# Altium project swagrocket555.PrjPcb
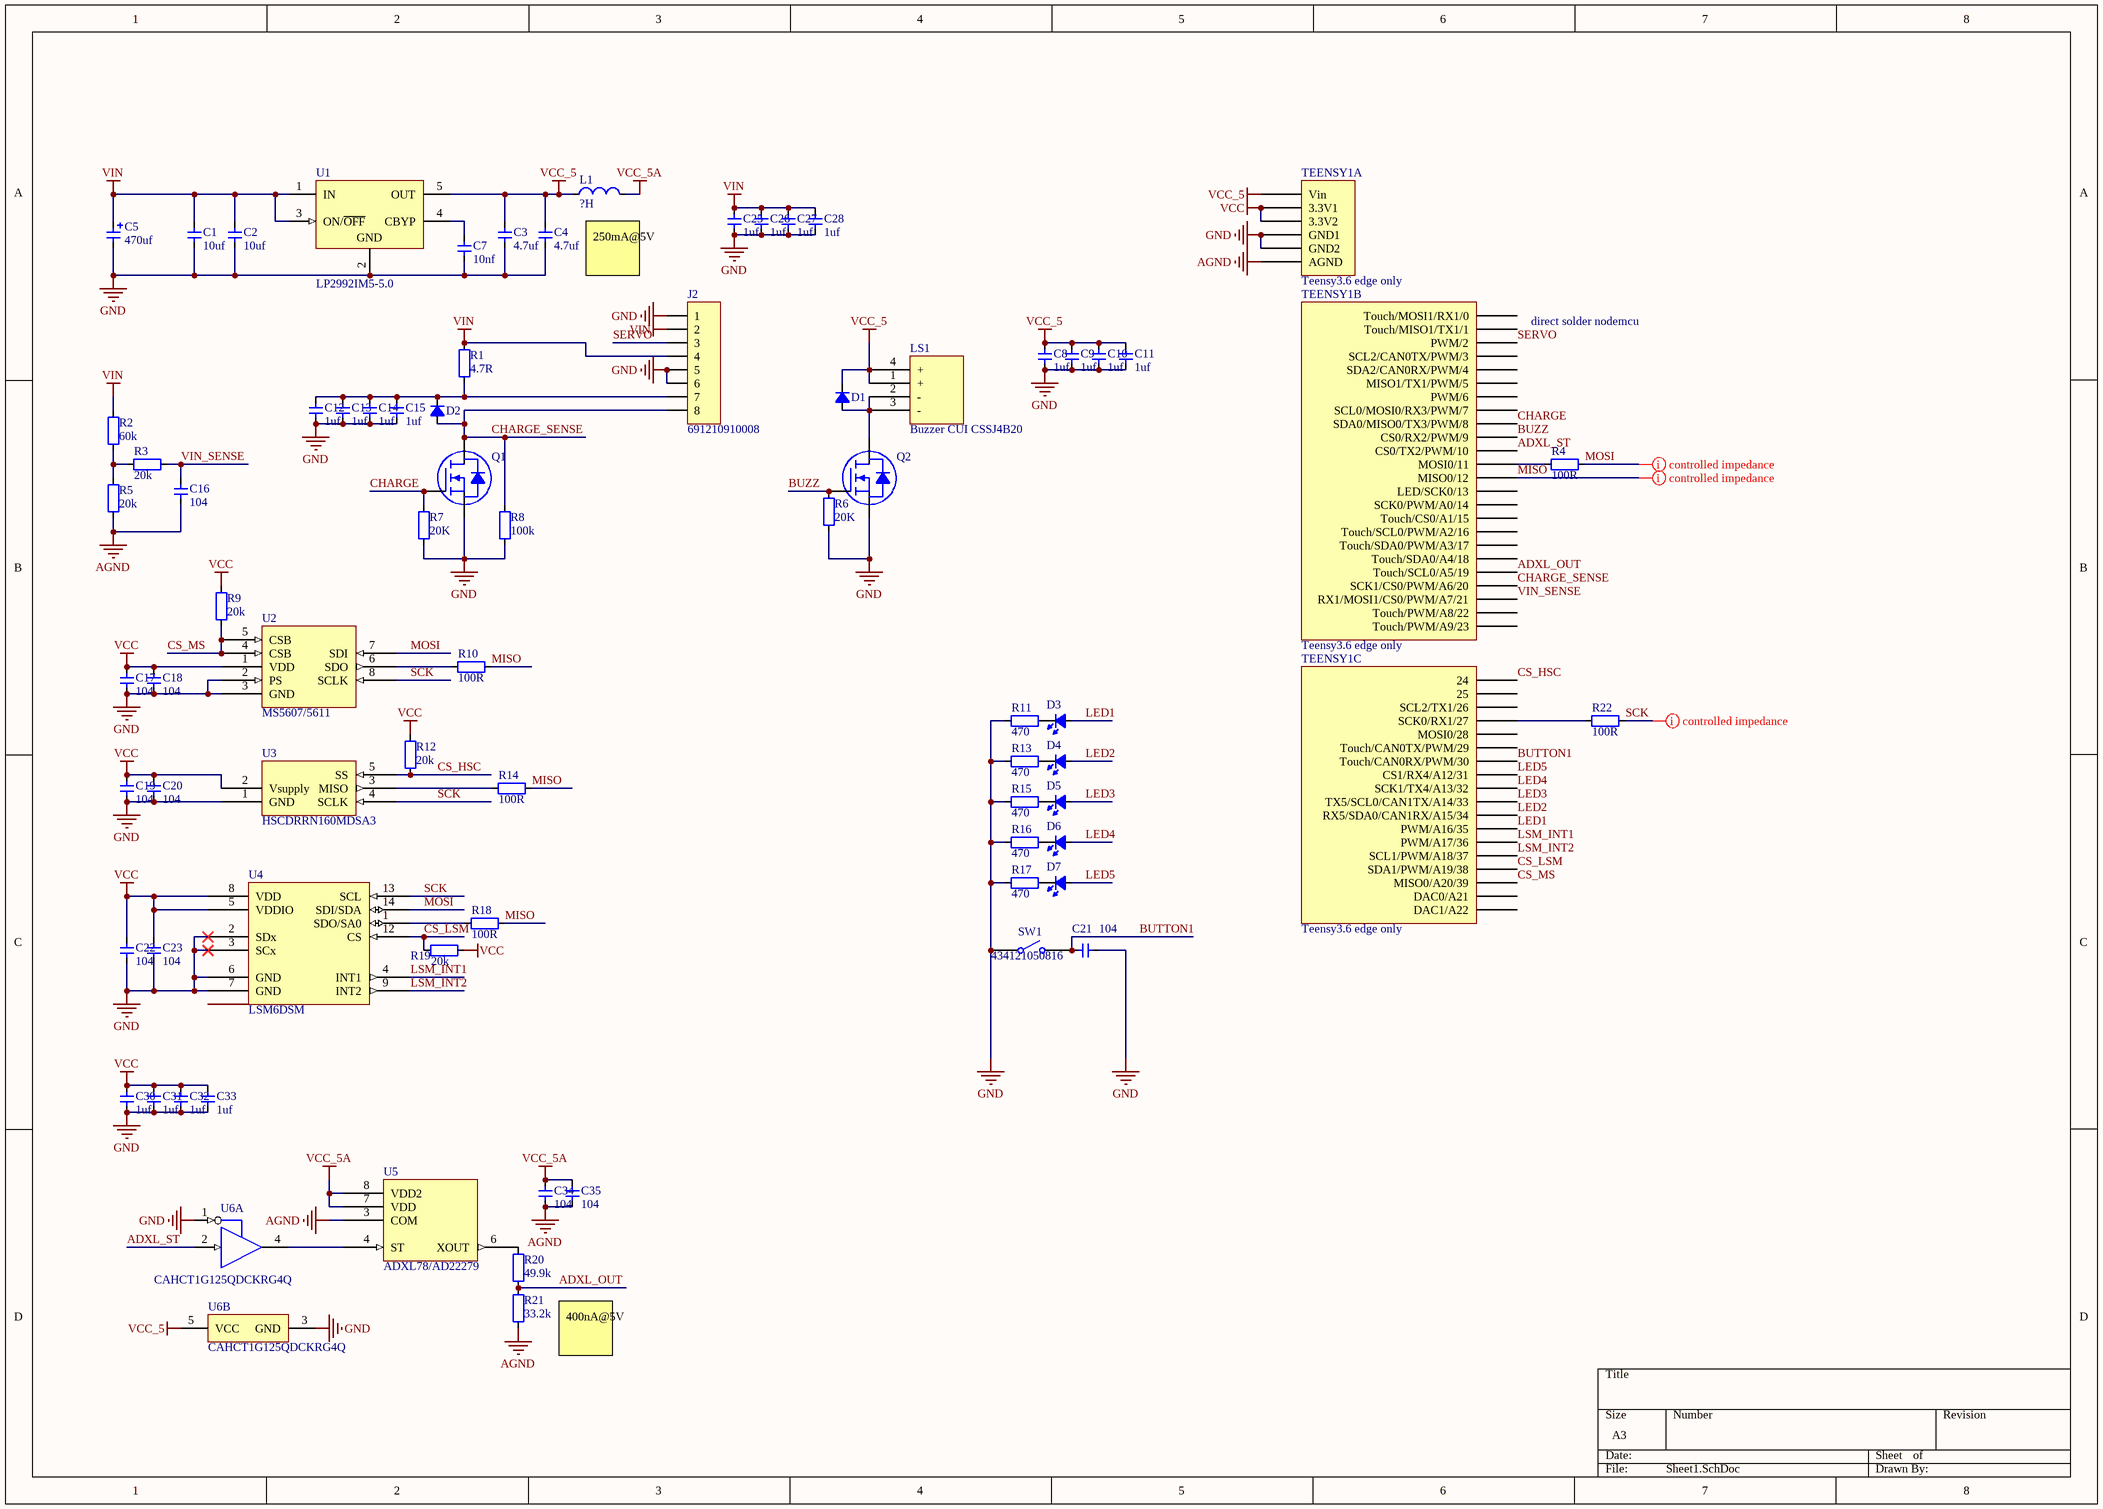
[diagram p0: Sheet1.SchDoc]
1 sheet, 74 parts. Net scope: global (net labels, ports and power ports of the same name join across sheets).
Board file: PCB1.PcbDoc

## Sheet Sheet1.SchDoc
size A3

### Parts
C1  value 10uf  [CAP_0805]  (hidden comment: Cap_0805)
C2  value 10uf  [CAP_0805]  (hidden comment: Cap_0805)
C3  value 4.7uf  [CAP_0805]  (hidden comment: Cap_0805)
C4  value 4.7uf  [CAP_0805]  (hidden comment: Cap_0805)
C5  value 470uf  [OFF_BOARD_CAP_3.5mm]  (hidden comment: Cap_Tan_2917)
C7  value 10nf  [CAP_0402]  (hidden comment: Cap_0402)
C8  value 1uf  [CAP_0603]  (hidden comment: Cap_0603)
C9  value 1uf  [CAP_0603]  (hidden comment: Cap_0603)
C10  value 1uf  [CAP_0603]  (hidden comment: Cap_0603)
C11  value 1uf  [CAP_0603]  (hidden comment: Cap_0603)
C12  value 1uf  [CAP_0603]  (hidden comment: Cap_0603)
C13  value 1uf  [CAP_0603]  (hidden comment: Cap_0603)
C14  value 1uf  [CAP_0603]  (hidden comment: Cap_0603)
C15  value 1uf  [CAP_0603]  (hidden comment: Cap_0603)
C16  value 104  [CAP_0402]  (hidden comment: Cap_0402)
C17  value 104  [CAP_0402]  (hidden comment: Cap_0402)
C18  value 104  [CAP_0402]  (hidden comment: Cap_0402)
C19  value 104  [CAP_0402]  (hidden comment: Cap_0402)
C20  value 104  [CAP_0402]  (hidden comment: Cap_0402)
C21  value 104  [CAP_0402]  (hidden comment: Cap_0402)
C22  value 104  [CAP_0402]  (hidden comment: Cap_0402)
C23  value 104  [CAP_0402]  (hidden comment: Cap_0402)
C25  value 1uf  [CAP_0603]  (hidden comment: Cap_0603)
C26  value 1uf  [CAP_0603]  (hidden comment: Cap_0603)
C27  value 1uf  [CAP_0603]  (hidden comment: Cap_0603)
C28  value 1uf  [CAP_0603]  (hidden comment: Cap_0603)
C30  value 1uf  [CAP_0603]  (hidden comment: Cap_0603)
C31  value 1uf  [CAP_0603]  (hidden comment: Cap_0603)
C32  value 1uf  [CAP_0603]  (hidden comment: Cap_0603)
C33  value 1uf  [CAP_0603]  (hidden comment: Cap_0603)
C34  value 104  [CAP_0402]  (hidden comment: Cap_0402)
C35  value 104  [CAP_0402]  (hidden comment: Cap_0402)
D1  Diode_SOD523  [SOT95P240X120-3N]  (value not drawn)
D2  Diode_SOD523  [SOT95P240X120-3N]  (value not drawn)
D3  LED_0402  [LED_0402_RED]  (value not drawn)
D4  LED_0402  [LED_0402_RED]  (value not drawn)
D5  LED_0402  [LED_0402_RED]  (value not drawn)
D6  LED_0402  [LED_0402_RED]  (value not drawn)
D7  LED_0402  [LED_0402_RED]  (value not drawn)
J2  691210910008  [691210910008]
L1  value ?H  [IND_0603]  (hidden comment: Ind_0603)
LS1  Buzzer CUI CSSJ4B20  [CUI Buzzer 8.5]
Q1  INFINEON MOSFET N-CH SOT-23-3  [INFINEON SOT-23-3]  (value not drawn)
Q2  INFINEON MOSFET N-CH SOT-23-3  [INFINEON SOT-23-3]  (value not drawn)
R1  value 4.7R  [RES_0805]  (hidden comment: Res_0805)
R2  value 60k  [RES_0402]  (hidden comment: Res_0402)
R3  value 20k  [RES_0402]  (hidden comment: Res_0402)
R4  value 100R  [RES_0402]  (hidden comment: Res_0402)
R5  value 20k  [RES_0402]  (hidden comment: Res_0402)
R6  value 20K  [RES_0402]  (hidden comment: Res_0402)
R7  value 20K  [RES_0402]  (hidden comment: Res_0402)
R8  value 100k  [RES_0402]  (hidden comment: Res_0402)
R9  value 20k  [RES_0402]  (hidden comment: Res_0402)
R10  value 100R  [RES_0402]  (hidden comment: Res_0402)
R11  value 470  [RES_0402]  (hidden comment: Res_0402)
R12  value 20k  [RES_0402]  (hidden comment: Res_0402)
R13  value 470  [RES_0402]  (hidden comment: Res_0402)
R14  value 100R  [RES_0402]  (hidden comment: Res_0402)
R15  value 470  [RES_0402]  (hidden comment: Res_0402)
R16  value 470  [RES_0402]  (hidden comment: Res_0402)
R17  value 470  [RES_0402]  (hidden comment: Res_0402)
R18  value 100R  [RES_0402]  (hidden comment: Res_0402)
R19  value 20k  [RES_0402]  (hidden comment: Res_0402)
R20  value 49.9k  [RES_0402]  (hidden comment: Res_0402)
R21  value 33.2k  [RES_0402]  (hidden comment: Res_0402)
R22  value 100R  [RES_0402]  (hidden comment: Res_0402)
SW1  434121050816  [434121050816]
TEENSY1  Teensy3.6 edge only  [Teensy3.6-edgeonly]  (parts A,B,C of 3)
U1  LP2992IM5-5.0  [DBV0005A_N]
U2  MS5607/5611  [MS5611]
U3  HSCDRRN160MDSA3  [honeywell-hsc-DIP8]
U4  LSM6DSM  [LGA14L_DOT_INDICATOR]
U5  ADXL78/AD22279  [ADI-E-8-1_V]
U6  CAHCT1G125QDCKRG4Q  [DCK0005A_M]  (parts A,B of 2)

### Nets
AGND: C16.1 C34.1 C35.1 R5.1 R21.1 TEENSY1.AGND U5.3(COM)
GND: C1.1 C2.1 C3.1 C4.1 C5.2 C7.1 C8.1 C9.1 C10.1 C11.1 C12.1 C13.1 C14.1 C15.1 C17.1 C18.1 C19.1 C20.1 C21.2 C22.1 C23.1 C25.1 C26.1 C27.1 C28.1 C30.1 C31.1 C32.1 C33.1 J2.1 J2.5 J2.6 Q1.3(S) Q2.3(S) R6.1 R7.1 R8.1 R11.1 R13.1 R15.1 R16.1 R17.1 SW1.1 TEENSY1.GND1 TEENSY1.GND2 U1.2(GND) U2.2(PS) U2.3(GND) U3.1(GND) U4.2(SDx) U4.3(SCx) U4.6(GND) U4.7(GND) U6.1(~{OE}) U6.3(GND)
VCC: C17.2 C18.2 C19.2 C20.2 C22.2 C23.2 C30.2 C31.2 C32.2 C33.2 R9.2 R12.2 R19.2 TEENSY1.3.3V1 TEENSY1.3.3V2 U2.1(VDD) U3.2(Vsupply) U4.5(VDDIO) U4.8(VDD)
VCC_5: C3.2 C4.2 C8.2 C9.2 C10.2 C11.2 D1.2(K) L1.1 LS1.1(+) LS1.4(+) TEENSY1.VIN(Vin) U1.5(OUT) U6.5(VCC)
VCC_5A: C34.2 C35.2 L1.2 U5.7(VDD) U5.8(VDD2)
VIN: C1.2 C2.2 C5.1 C25.2 C26.2 C27.2 C28.2 J2.2 J2.4 R1.2 R2.2 U1.1(IN) U1.3(ON/~{OFF})
ADXL_OUT: R20.2 R21.2 TEENSY1.19(Touch/SCL0/A5/19)
ADXL_ST: TEENSY1.10(CS0/TX2/PWM/10) U6.2(A)
BUTTON1: C21.1 SW1.2 TEENSY1.30(Touch/CAN0RX/PWM/30)
BUZZ: Q2.1(G) R6.2 TEENSY1.9(CS0/RX2/PWM/9)
CHARGE: Q1.1(G) R7.2 TEENSY1.8(SDA0/MISO0/TX3/PWM/8)
CHARGE_SENSE: D2.1(A) J2.8 Q1.2(D) R8.2 TEENSY1.20(SCK1/CS0/PWM/A6/20)
CS_HSC: R12.1 TEENSY1.24 U3.5(SS)
CS_LSM: R19.1 TEENSY1.38(SDA1/PWM/A19/38) U4.12(CS)
CS_MS: R9.1 TEENSY1.39(MISO0/A20/39) U2.4(CSB) U2.5(CSB)
LED1: D3.1(A) TEENSY1.35(PWM/A16/35)
LED2: D4.1(A) TEENSY1.34(RX5/SDA0/CAN1RX/A15/34)
LED3: D5.1(A) TEENSY1.33(TX5/SCL0/CAN1TX/A14/33)
LED4: D6.1(A) TEENSY1.32(SCK1/TX4/A13/32)
LED5: D7.1(A) TEENSY1.31(CS1/RX4/A12/31)
LSM_INT1: TEENSY1.36(PWM/A17/36) U4.4(INT1)
LSM_INT2: TEENSY1.37(SCL1/PWM/A18/37) U4.9(INT2)
MISO: R10.2 R14.2 R18.2 TEENSY1.12(MISO0/12)
MOSI: R4.2 U2.7(SDI) U4.14(SDI/SDA)
SCK: R22.2 U2.8(SCLK) U3.4(SCLK) U4.13(SCL)
SERVO: J2.3 TEENSY1.2(PWM/2)
VIN_SENSE: C16.2 R3.1 TEENSY1.21(RX1/MOSI1/CS0/PWM/A7/21)
NetC7_2: C7.2 U1.4(CBYP)
NetC12_2: C12.2 C13.2 C14.2 C15.2 D2.2(K) J2.7 R1.1
NetD1_1: D1.1(A) LS1.2(-) LS1.3(-) Q2.2(D)
NetD3_2: D3.2(K) R11.2
NetD4_2: D4.2(K) R13.2
NetD5_2: D5.2(K) R15.2
NetD6_2: D6.2(K) R16.2
NetD7_2: D7.2(K) R17.2
NetR2_1: R2.1 R3.2 R5.2
NetR4_1: R4.1 TEENSY1.11(MOSI0/11)
NetR10_1: R10.1 U2.6(SDO)
NetR14_1: R14.1 U3.3(MISO)
NetR18_1: R18.1 U4.1(SDO/SA0)
NetR20_1: R20.1 U5.6(XOUT)
NetR22_1: R22.1 TEENSY1.27(SCK0/RX1/27)
NetU5_4: U5.4(ST) U6.4(Y)

Not connected (* = marked no-connect by the designer): TEENSY1 0(Touch/MOSI1/RX1/0) 1(Touch/MISO1/TX1/1) 3(SCL2/CAN0TX/PWM/3) 4(SDA2/CAN0RX/PWM/4) 5(MISO1/TX1/PWM/5) 6(PWM/6) 7(SCL0/MOSI0/RX3/PWM/7) 13(LED/SCK0/13) 14(SCK0/PWM/A0/14) 15(Touch/CS0/A1/15) 16(Touch/SCL0/PWM/A2/16) 17(Touch/SDA0/PWM/A3/17) 18(Touch/SDA0/A4/18) 22(Touch/PWM/A8/22) 23(Touch/PWM/A9/23) 25 26(SCL2/TX1/26) 28(MOSI0/28) 29(Touch/CAN0TX/PWM/29) A21(DAC0/A21) A22(DAC1/A22)

### Layout directives
net class CI: MISO, MOSI, SCK

### Notes on the sheet
- 250mA@5V
- direct solder nodemcu
- 400nA@5V

### Library data of the parts
C1-C4 = Cap_0805: Capacitor
C5 = Cap_Tan_2917: Capacitor
C7 C16-C23 C34 C35 = Cap_0402: Capacitor
C8-C15 C25-C28 C30-C33 = Cap_0603: Capacitor
D1 D2 = Diode_SOD523: Diode; pin to pad: 2>3; url: http://www.digikey.com/product-detail/en/nxp-usa-inc/PMEG2010AEB,115/568-6502-1-ND/2531789
D3-D7 = LED_0402: LED
J2 = 691210910008: WR-TBL Terminal Blocks Serie 2109 - 2.54 mm with Rising Cage Clamp; Manufacturer: Würth Elektronik eiSos GmbH; ComponentLink1 Description: Manufacturer; ComponentLink2 Description: Datasheet; NoPins: 8; Created Date: 8 Novenber 2013; partNo: 691210910008; ComponentLink1URL: http://www.we-online.com; ComponentLink2URL: http://katalog.we-online.de/em/datasheet/6912109100xx.pdf; Created by: Karrer Zheng
L1 = Ind_0603: Inductor
LS1 = CSS-J4B20
R1 = Res_0805: Resistor
R2-R22 = Res_0402: Resistor
SW1 = CMP-1459-00007-1: WS-TASV SMD Tact Switch 6.0X3.5 mm; Manufacturer: Wuerth Elektronik; NoPins: 02; ComponentLink1Description: Manufacturer URL; PackageReference: 434121050816; PartNumber: 434121050816; ComponentLink2URL: http://katalog.we-online.de/em/datasheet/434121050816.pdf; ComponentLink1URL: http://www.we-online.com; ComponentLink2Description: Datasheet
U1 = CMP-0062-02178-3: Micropower 250 mA Low-Noise Ultra Low-Dropout Regulator, 5-pin SOT-23; Manufacturer: Texas Instruments; CompType: LDO IC; PowerWise: N; PackageTopMarking: LFFB*XTT; PinCount: 5; ComponentLink1URL: http://www.ti.com/general/docs/lit/getliterature.tsp?genericPartNumber=LP2992&fileType=pdf; PackageDescription: Molded SOT-23, .115 x .063 x .040 in Body, 5 Lead, .0375 in Pitch; ComponentLink1Description: Datasheet URL; RoHS: N; PackageReference: DBV0005A
U2 = MS5611
U3 = honeywell-hsc-spi
U4 = LSM6DS3
U5 = ADXL78
U6 = CMP-0859-00347-3: Automotive Catalog Single Bus Buffer Gate With 3-State Output, DCK0005A, LARGE T&R; Generic Part Number: SN74AHCT1G125-Q1; Manufacturer: Texas Instruments; F @ Nom Voltage(Max)(Mhz): 75; ICC @ Nom Voltage(Max)(mA): 0.01; Output Drive (IOL/IOH)(Max)(mA): 8/-8; Logic: True; Voltage(Nom)(V): 5; tpd @ Nom Voltage(Max)(ns): 6; VCC(Min)(V): 3; Technology Family: AHCT; 3-State Output: Yes; Bits(#): 1; Sub-Family: Non-Inverting Buffer/Driver; Input Type: CMOS; Schmitt Trigger: No; VCC(Max)(V): 5.5; PackageReference: DCK0005A; Rating: Automotive; DatasheetVersion: SCLS504B; Operating Temperature Range(C): -40 to 125; Output Type: CMOS; PartId: 1